# EasyEDA Pro project pcb_design.epro, schematic 控制板
Create Date: 2024-05-09; Page Name: P1; Project Name: ESP32 WS2812B的音乐频谱仪; Schematic Name: 控制板; Update Date: 2024-05-11; Company: 嘉立创EDA; Page Size: A4; Version: V1.0
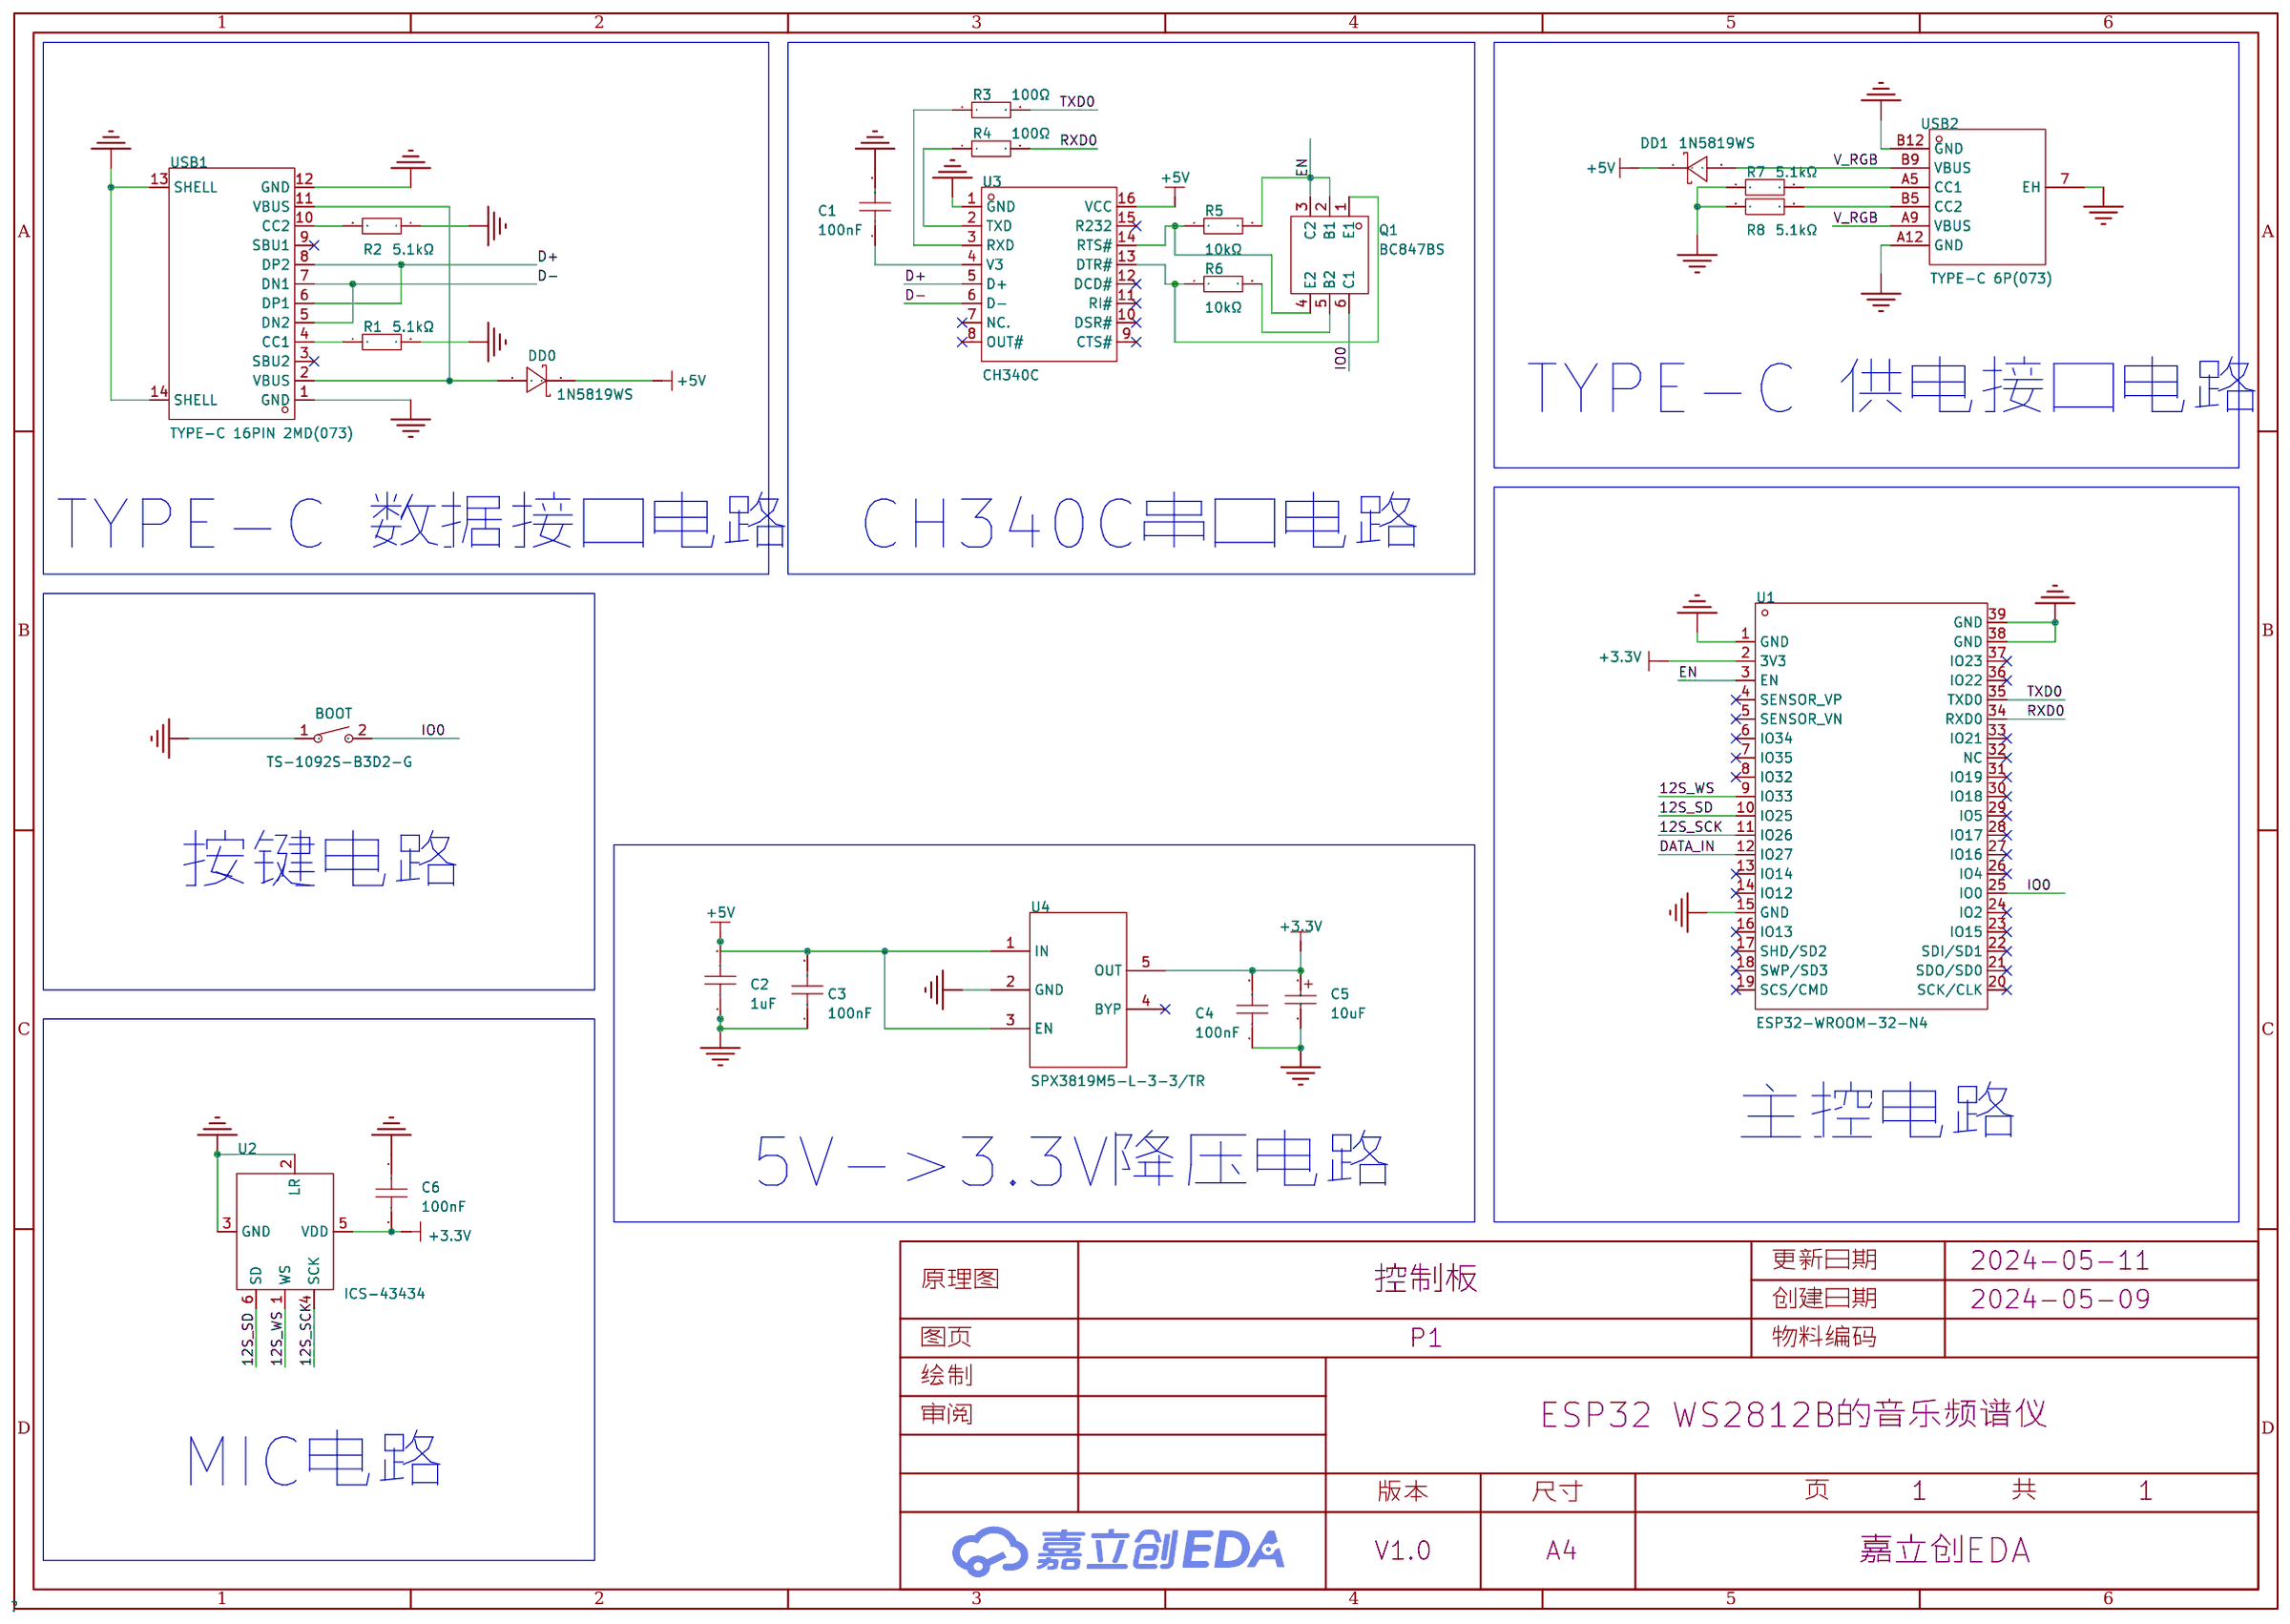
[diagram p0: schematic sheet]

## Parts
BOOT  TS-1092S-B3D2-G  [SW-SMD_L6.1-W3.6-LS7.9]
C1  100nF  [C0603]
C2  1uF  [C0603]
C3  100nF  [C0603]
C4  100nF  [C0603]
C5  10uF  [CAP-SMD_L3.2-W1.6-RD]
C6  100nF  [C0603]
DD0  1N5819WS  [SOD-323_L1.8-W1.3-LS2.5-RD]
DD1  1N5819WS  [SOD-323_L1.8-W1.3-LS2.5-RD]
Q1  BC847BS  [SOT-363_L2.0-W1.3-P0.65-LS2.1-BR]
R1  5.1kΩ  [R0603]
R2  5.1kΩ  [R0603]
R3  100Ω  [R0603]
R4  100Ω  [R0603]
R5  10kΩ  [R0603]
R6  10kΩ  [R0603]
R7  5.1kΩ  [R0603]
R8  5.1kΩ  [R0603]
U1  ESP32-WROOM-32-N4  [WIFIM-SMD_ESP32-WROOM-32-N4]
U2  ICS-43434  [MIC-SMD_6P-L3.5-W2.7-P0.90-BL]
U3  CH340C  [SOP-16_L10.0-W3.9-P1.27-LS6.0-BL]
U4  SPX3819M5-L-3-3/TR  [SOT-23-5_L3.0-W1.7-P0.95-LS2.8-BL]
USB1  TYPE-C 16PIN 2MD(073)  [USB-C-SMD_TYPE-C-6PIN-2MD-073]
USB2  TYPE-C 6P(073)  [TYPE-C-SMD_TYPE-C-6P]

## Library data of the parts
BOOT = TS-1092S-B3D2-G: 电路结构:单刀单掷;安装方式:立贴;作用力:250gf@±30gf;机械寿命:-;带支架:否;; LCSC Part Name: 6.1*3.6*2.5mm 立贴 轻触开关; Supplier Part: C520860; Manufacturer: Yuandi(元迪); Supplier Footprint: SMD; JLCPCB Part Class: 扩展库; Datasheet: https://atta.szlcsc.com/upload/public/pdf/source/20200424/C520860_DA5AE47D9A9DC527FC720B5FF0895739.pdf; Supplier: LCSC; Circuit: 单刀单掷; Mounting Style: 立贴; Actuator Style: 矩形按钮; Actuator/Cap Color: 灰色; Operating Force: 250gf@±30gf; Pin Style: 鸥翼型; Switch Length: 6.1mm; Switch Width: 3.6mm; Switch Height: 2.5mm; Strike Gundam: 否; Check: false
C1 C3 C4 C6 = CL10B104KB8NNNC: 容值:100nF;精度:±10%;额定电压:50V;材质(温度系数):X7R;; LCSC Part Name: 100nF ±10% 50V; Supplier Part: C1591; Manufacturer: SAMSUNG(三星); Supplier Footprint: 0603; JLCPCB Part Class: 扩展库; Datasheet: https://atta.szlcsc.com/upload/public/pdf/source/20160218/1457707763339.pdf; Supplier: LCSC; Tolerance: ±10%; Voltage Rated: 50V; Temperature Coefficient: X7R; Check: false
C2 = CL10A105KB8NNNC: 容值:1uF;精度:±10%;额定电压:50V;材质(温度系数):X5R;; LCSC Part Name: 1uF ±10% 50V; Supplier Part: C15849; Manufacturer: SAMSUNG(三星); Supplier Footprint: 0603; JLCPCB Part Class: 基础库; Datasheet: https://atta.szlcsc.com/upload/public/pdf/source/20160218/1457707763339.pdf; Supplier: LCSC; Tolerance: ±10%; Voltage Rated: 50V; Temperature Coefficient: X5R; Check: false
C5 = CA45-A-16V-10uF-K: 容值:10uF;精度:±10%;额定电压:16V;等效串联电阻:10Ω@100kHz;; LCSC Part Name: 10uF ±10% 16V; Supplier Part: C128254; Manufacturer: CEC(振华新云); Supplier Footprint: CASE-A-3216; JLCPCB Part Class: 扩展库; Datasheet: https://atta.szlcsc.com/upload/public/pdf/source/20170914/C128254_1505359752472967905.pdf; Supplier: LCSC; Tolerance: ±10%; Rated Voltage: 16V; Equivalent Series Resistance(ESR): 10Ω@100kHz; Operating Temperature: -55℃~+125℃
DD0 DD1 = 1N5819WS_C191023: 正向压降(Vf):600mV@1A;直流反向耐压(Vr):40V;平均整流电流(Io):1A;; LCSC Part Name: 电压:40V 电流:1A; Supplier Part: C191023; Manufacturer: Hottech(合科泰); Supplier Footprint: SOD-323; JLCPCB Part Class: Basic Part; Datasheet: https://atta.szlcsc.com/upload/public/pdf/source/20220428/3CB86FD8D28D653594B4E35F9D5AEFD9.pdf; Supplier: LCSC; Forward Voltage (Vf@If): 600mV@1A; Reverse Voltage (Vr): 40V; Average Rectified Current (Io): 1A; Check: false
Q1 = BC847BS_C5380687: 晶体管类型:NPN;集电极电流(Ic):100mA;集射极击穿电压(Vceo):45V;功率(Pd):200mW;直流电流增益(hFE@Ic,Vce):450@2mA,5V;; LCSC Part Name: 耐压:45V 电流:100mA NPN; Supplier Part: C5380687; Manufacturer: FUXINSEMI(富芯森美); Supplier Footprint: SOT-363; JLCPCB Part Class: Extended Part; Datasheet: https://atta.szlcsc.com/upload/public/pdf/source/20230323/4941A6244CF9054BEEC3CB28C58D406A.pdf; Supplier: LCSC; Transistor Type: NPN; Collector Current (Ic): 100mA; Collector-Emitter Breakdown Voltage (Vceo): 45V; Power Dissipation (Pd): 200mW; DC Current Gain (hFE@Ic,Vce): 450@2mA,5V; Transition Frequency (fT): 200MHz; Collector Cut-Off Current (Icbo): 15nA; Collector-Emitter Saturation Voltage (VCE(sat)@Ic,Ib): 650mV@100mA,5mA; Operating Temperature: -55℃~+150℃; Check: false
R1 R2 R7 R8 = 0603WAF5101T5E: 阻值:5.1kΩ;精度:±1%;功率:100mW;温度系数:±100ppm/℃;电阻类型:厚膜电阻;; LCSC Part Name: 5.1kΩ ±1% 100mW 厚膜电阻; Supplier Part: C23186; Manufacturer: UNI-ROYAL(厚声); Supplier Footprint: 0603; JLCPCB Part Class: 基础库; Datasheet: https://atta.szlcsc.com/upload/public/pdf/source/20200306/C422600_1E6D84923E4A46A82E41ADD87F860B5C.pdf; Supplier: LCSC; Tolerance: ±1%; Power(Watts): 100mW; Overload Voltage (Max): 75V; Temperature Coefficient: ±100ppm/℃; Type: 厚膜电阻; Operating Temperature Range: -55℃~+155℃; Check: false
R3 R4 = RC0603FR-07100RL: 电阻类型:厚膜电阻;阻值:100Ω;精度:±1%;功率:100mW;; LCSC Part Name: 100Ω ±1% 100mW; Supplier Part: C105588; Manufacturer: YAGEO(国巨); Supplier Footprint: 0603; JLCPCB Part Class: 扩展库; Datasheet: https://atta.szlcsc.com/upload/public/pdf/source/20170428/1493376742308.pdf; Supplier: LCSC; Type: 厚膜电阻; Tolerance: ±1%; Power(Watts): 100mW; Temperature Coefficient: ±100ppm/℃; Overload Voltage (Max): 75V; Operating Temperature Range: -55℃~+155℃
R5 R6 = 0603WAF1002T5E: 阻值:10kΩ;精度:±1%;功率:100mW;温度系数:±100ppm/℃;电阻类型:厚膜电阻;; LCSC Part Name: 10kΩ ±1% 100mW 厚膜电阻; Supplier Part: C25804; Manufacturer: UNI-ROYAL(厚声); Supplier Footprint: 0603; JLCPCB Part Class: 基础库; Datasheet: https://atta.szlcsc.com/upload/public/pdf/source/20200306/C422600_1E6D84923E4A46A82E41ADD87F860B5C.pdf; Supplier: LCSC; Tolerance: ±1%; Power(Watts): 100mW; Overload Voltage (Max): 75V; Temperature Coefficient: ±100ppm/℃; Type: 厚膜电阻; Operating Temperature Range: -55℃~+155℃; Check: false
U1 = ESP32-WROOM-32-N4: WiFi+蓝牙4.2+双核CPU,ESP32; LCSC Part Name: WiFi+蓝牙4.2+双核CPU模块; Supplier Part: C82899; Manufacturer: ESPRESSIF(乐鑫); Supplier Footprint: SMD,18x25.5mm; JLCPCB Part Class: Extended Part; Datasheet: https://atta.szlcsc.com/upload/public/pdf/source/20210719/C82899_2D52724B6FAFABC419BCF308C5944296.pdf; Supplier: LCSC; Check: false
U2 = ICS-43434: Supplier Part: C9900000518; Supplier Footprint: SMD_2.65X3.5; JLCPCB Part Class: 扩展库; Datasheet: 2021-09-27/871184A/aa9d1109048a4e3fb0c66b359aba0933/ICS43434.pdf; Supplier: LCSC; Check: false
U3 = CH340C: 应用功能:收发器;接口协议:USB 2.0;数据速率:2Mbps;; LCSC Part Name: CH340C USB转串口芯片 CH340; Supplier Part: C84681; Manufacturer: WCH(南京沁恒); Supplier Footprint: SOP-16; JLCPCB Part Class: Extended Part; Datasheet: https://atta.szlcsc.com/upload/public/pdf/source/20200819/C84681_ADBED554CE321879DBD6B1D06488689C.pdf; Supplier: LCSC; Applications Function: 收发器; Protocol: USB 2.0; Data Rate: 2Mbps; Supply Voltage: 3.3V；5V; Check: false
U4 = SPX3819M5-L-3-3/TR: 输出类型:固定;输出极性:正;最大输入电压:16V;输出电压:3.3V;输出电流:500mA;电源纹波抑制比(PSRR):70dB;; LCSC Part Name: 输入16V 输出3.3V 500mA; Supplier Part: C9055; Manufacturer: MaxLinear; Supplier Footprint: SOT-23-5; JLCPCB Part Class: Extended Part; Datasheet: https://atta.szlcsc.com/upload/public/pdf/source/20150720/1457707331934.pdf; Supplier: LCSC; Output Type: 固定; Output Polarity: 正; Number of Outputs: 1; Maximum Input Voltage: 16V; Output Voltage: 3.3V; Dropout Voltage: 700mV@(500mA); Quiescent Current (Ground Current): 8uA; Output Current: 500mA; Power Supply Rejection Ratio (PSRR): 70dB; Operating Temperature: -40℃~+125℃; Check: false
USB1 = TYPE-C 16PIN 2MD(073): 连接器类型:Type-C;标准:-;公母:母;触点数量:16P;端口数量:1;安装方式:卧贴;额定电流 - 电源:5A;工作温度范围:-25℃~+85℃;; LCSC Part Name: Type-C 母 卧贴 带定位柱 不锈钢外壳 2次模顶; Supplier Part: C2765186; Manufacturer: SHOU HAN(首韩); Supplier Footprint: SMD; JLCPCB Part Class: Extended Part; Datasheet: https://atta.szlcsc.com/upload/public/pdf/source/20211123/39B17C16241EAC15C5E277BDA434118E.pdf; Supplier: LCSC; Connector Type: Type-C; Gender: 母; Number of Contacts: 16P; Number of Ports: 1; Mounting Style: 卧贴; Current Rating - Power (Max): 5A; Operating Temperature Range: -25℃~+85℃; Check: false
USB2 = TYPE-C 6P(073): 连接器类型:Type-C;标准:-;公母:母;触点数量:6P;端口数量:1;安装方式:卧贴;额定电流 - 电源:5A;工作温度范围:-25℃~+85℃;; LCSC Part Name: Type-C 母 卧贴; Supplier Part: C668623; Manufacturer: SHOU HAN(首韩); Supplier Footprint: SMD; JLCPCB Part Class: Extended Part; Datasheet: https://atta.szlcsc.com/upload/public/pdf/source/20200618/C668623_A4B260DED7AC1949BAC6AE39E9F4CD80.pdf; Supplier: LCSC; Connector Type: Type-C; Gender: 母; Number of Contacts: 6P; Number of Ports: 1; Mounting Style: 卧贴; Current Rating - Power (Max): 5A; Operating Temperature Range: -25℃~+85℃; Check: false

## Nets
+3.3V: C4.2 C5.1 C6.2 U1.2(3V3) U2.5(VDD) U4.5(OUT)
+5V: C2.2 C3.2 DD0.1(K) DD1.1(K) U3.16(VCC) U4.1(IN) U4.3(EN)
GND: BOOT.1 C1.2 C2.1 C3.1 C4.1 C5.2 C6.1 R1.2 R2.1 R7.1 R8.1 U1.1(GND) U1.15(GND) U1.38(GND) U1.39(GND) U2.2(LR) U2.3(GND) U3.1(GND) U4.2(GND) USB1.1(GND) USB1.12(GND) USB1.13(SHELL) USB1.14(SHELL) USB2.7(EH) USB2.A12(GND) USB2.B12(GND)
12S_SCK: U1.11(IO26) U2.4(SCK)
12S_SD: U1.10(IO25) U2.6(SD)
12S_WS: U1.9(IO33) U2.1(WS)
D+: U3.5(D+) USB1.6(DP1) USB1.8(DP2)
D-: U3.6(D-) USB1.5(DN2) USB1.7(DN1)
DATA_IN: U1.12(IO27)
EN: Q1.3(C2) U1.3(EN)
IO0: BOOT.2 Q1.6(C1) U1.25(IO0)
RXD0: R4.2 U1.34(RXD0)
TXD0: R3.2 U1.35(TXD0)
V_RGB: DD1.2(A) USB2.A9(VBUS) USB2.B9(VBUS)
$1N5236: R7.2 USB2.A5(CC1)
$1N5237: R8.2 USB2.B5(CC2)
$1N5283: Q1.4(E2) R5.1 U3.14(RTS#)
$1N5284: Q1.1(E1) R6.1 U3.13(DTR#)
$1N5285: Q1.5(B2) R6.2
$1N5286: Q1.2(B1) R5.2
$1N5289: C1.1 U3.4(V3)
$1N5291: R3.1 U3.3(RXD)
$1N5292: R4.1 U3.2(TXD)
$1N5300: DD0.2(A) USB1.2(VBUS) USB1.11(VBUS)
$1N5301: R1.1 USB1.4(CC1)
$1N5302: R2.2 USB1.10(CC2)

Not connected (* = marked no-connect by the designer): U1 4(SENSOR_VP)* 5(SENSOR_VN)* 6(IO34)* 7(IO35)* 8(IO32)* 13(IO14)* 14(IO12)* 16(IO13)* 17(SHD/SD2)* 18(SWP/SD3)* 19(SCS/CMD)* 20(SCK/CLK)* 21(SDO/SD0)* 22(SDI/SD1)* 23(IO15)* 24(IO2)* 26(IO4)* 27(IO16)* 28(IO17)* 29(IO5)* 30(IO18)* 31(IO19)* 32(NC)* 33(IO21)* 36(IO22)* 37(IO23)*; U3 7(NC.)* 8(OUT#)* 9(CTS#)* 10(DSR#)* 11(RI#)* 12(DCD#)* 15(R232)*; U4 4(BYP)*; USB1 3(SBU2)* 9(SBU1)*

## Notes on the sheet
- TYPE-C 供电接口电路
- TYPE-C 数据接口电路
- CH340C串口电路
- 按键电路
- 主控电路
- 5V->3.3V降压电路
- MIC电路
